# Altium schematic sheet 03_GPRS.SchDoc
size A3; DocumentNumber: 3; SheetNumber: 3; SheetTotal: 5
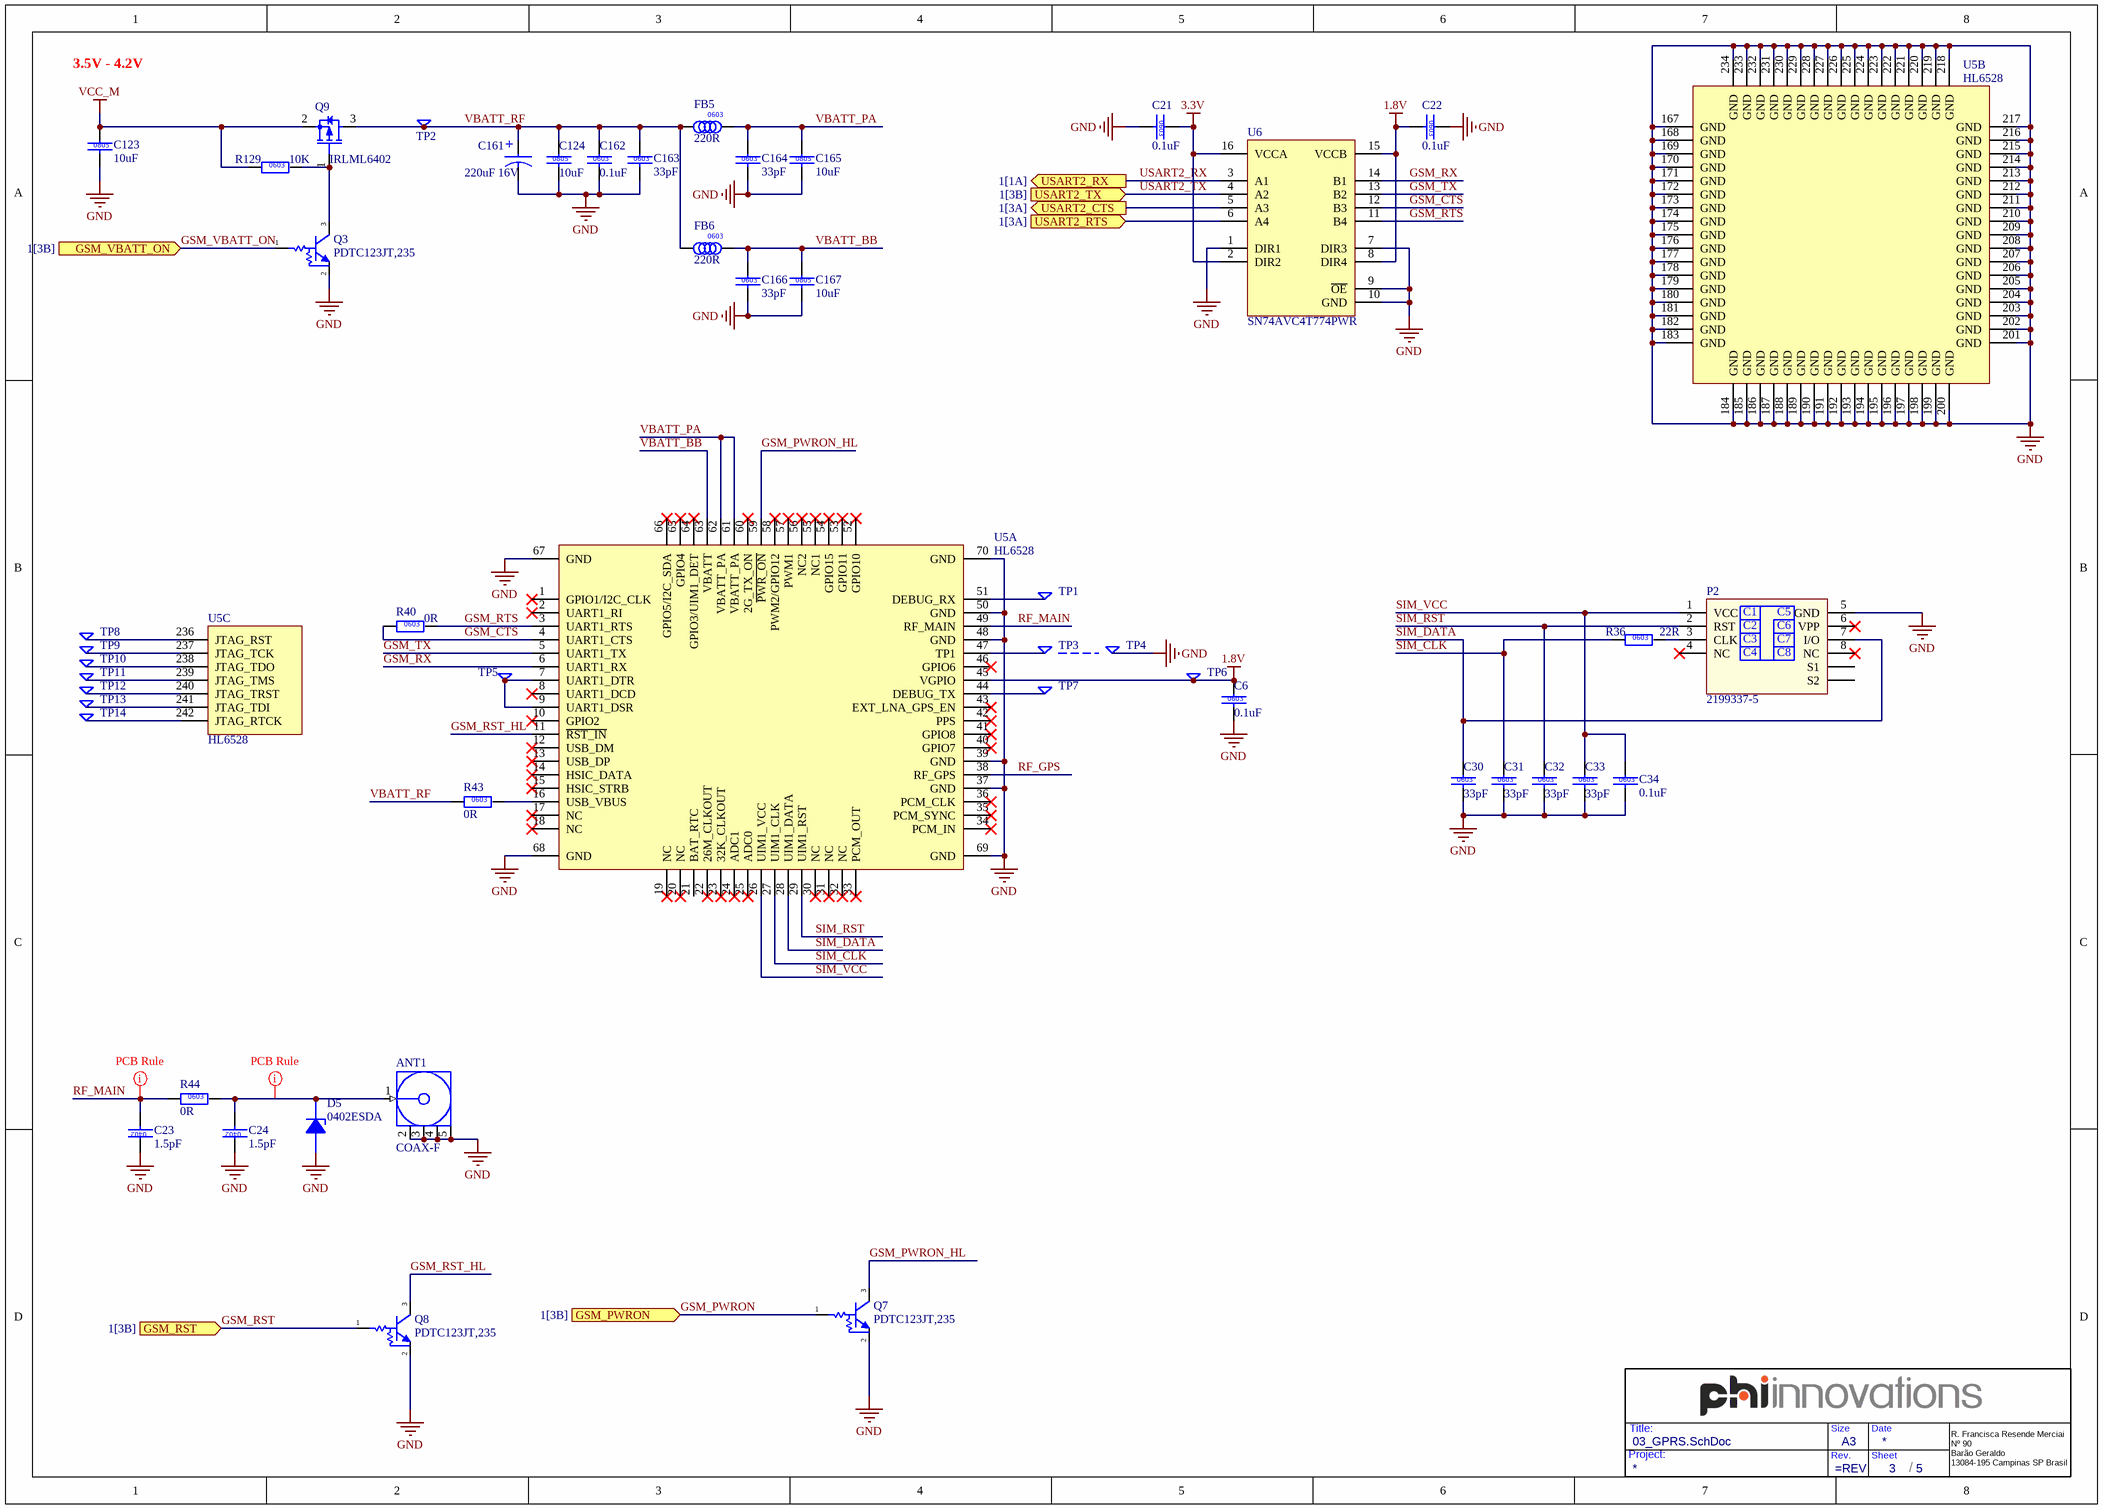
[diagram p0: 03_GPRS.SchDoc]

## Parts
?  (no value)  (graphical)
ANT1  COAX-F  [antena]
C6  0.1uF  [0603C]
C21  0.1uF  [0603C]
C22  0.1uF  [0603C]
C23  1.5pF  [0402C]
C24  1.5pF  [0402C]
C30  33pF  [0603C]
C31  33pF  [0603C]
C32  33pF  [0603C]
C33  33pF  [0603C]
C34  0.1uF  [0603C]
C123  10uF  [0805C]
C124  10uF  [0805C]
C161  220uF 16V  [CAP_RADIAL_6X11]
C162  0.1uF  [0603C]
C163  33pF  [0603C]
C164  33pF  [0603C]
C165  10uF  [0805C]
C166  33pF  [0603C]
C167  10uF  [0805C]
D5  0402ESDA  [0402ESD]
FB5  220R  [0603L]
FB6  220R  [0603L]
P2  2199337-5  [SIM_MICRO_2108431-3]
Q3  PDTC123JT,235  [SOT-23-3]
Q7  PDTC123JT,235  [SOT-23-3]
Q8  PDTC123JT,235  [SOT-23-3]
Q9  IRLML6402  [SOT-23]
R36  22R  [0603R]
R40  0R  [0603R]
R43  0R  [0603R]
R44  0R  [0603R]
R129  10K  [0603R]
TP1  TP  [TP]  (value not drawn)  (no BOM)
TP2  TP  [TP]  (value not drawn)  (no BOM)
TP3  TP  [TP]  (value not drawn)  (no BOM)
TP4  TP  [TP]  (value not drawn)  (no BOM)
TP5  TP  [TP]  (value not drawn)  (no BOM)
TP6  TP  [TP]  (value not drawn)  (no BOM)
TP7  TP  [TP]  (value not drawn)  (no BOM)
TP8  TP  [TP]  (value not drawn)  (no BOM)
TP9  TP  [TP]  (value not drawn)  (no BOM)
TP10  TP  [TP]  (value not drawn)  (no BOM)
TP11  TP  [TP]  (value not drawn)  (no BOM)
TP12  TP  [TP]  (value not drawn)  (no BOM)
TP13  TP  [TP]  (value not drawn)  (no BOM)
TP14  TP  [TP]  (value not drawn)  (no BOM)
U5  HL6528  [3G_HL8549]  (parts A,B,C of 3)
U6  SN74AVC4T774PWR  [TSSOP16]

## Ports
GSM_PWRON (in, see 1[3B]), GSM_RST (in, see 1[3B]), GSM_VBATT_ON (in, see 1[3B]), USART2_CTS (out, see 1[3A]), USART2_RTS (in, see 1[3A]), USART2_RX (out, see 1[1A]), USART2_TX (in, see 1[3B])

## Nets
1.8V: C6.1 C22.2 TP6.1 U5.45(VGPIO) U6.8(DIR4) U6.15(VCCB)
3.3V: C21.1 U6.2(DIR2) U6.16(VCCA)
GND: ANT1.2(GND) ANT1.3(GND) ANT1.4(GND) ANT1.5(GND) C6.2 C21.2 C22.1 C23.1 C24.1 C30.2 C31.2 C32.2 C33.2 C34.2 C123.2 C124.2 C161.2 C162.2 C163.2 C164.2 C165.2 C166.2 C167.2 D5.2(A) P2.5(GND) Q3.2(E) Q7.2(E) Q8.2(E) TP4.1 U5.37(GND) U5.39(GND) U5.48(GND) U5.50(GND) U5.67(GND) U5.68(GND) U5.69(GND) U5.70(GND) U5.167(GND) U5.168(GND) U5.169(GND) U5.170(GND) U5.171(GND) U5.172(GND) U5.173(GND) U5.174(GND) U5.175(GND) U5.176(GND) U5.177(GND) U5.178(GND) U5.179(GND) U5.180(GND) U5.181(GND) U5.182(GND) U5.183(GND) U5.184(GND) U5.185(GND) U5.186(GND) U5.187(GND) U5.188(GND) U5.189(GND) U5.190(GND) U5.191(GND) U5.192(GND) U5.193(GND) U5.194(GND) U5.195(GND) U5.196(GND) U5.197(GND) U5.198(GND) U5.199(GND) U5.200(GND) U5.201(GND) U5.202(GND) U5.203(GND) U5.204(GND) U5.205(GND) U5.206(GND) U5.207(GND) U5.208(GND) U5.209(GND) U5.210(GND) U5.211(GND) U5.212(GND) U5.213(GND) U5.214(GND) U5.215(GND) U5.216(GND) U5.217(GND) U5.218(GND) U5.219(GND) U5.220(GND) U5.221(GND) U5.222(GND) U5.223(GND) U5.224(GND) U5.225(GND) U5.226(GND) U5.227(GND) U5.228(GND) U5.229(GND) U5.230(GND) U5.231(GND) U5.232(GND) U5.233(GND) U5.234(GND) U6.1(DIR1) U6.7(DIR3) U6.9(~{OE}) U6.10(GND)
VCC_M: C123.1 Q9.2(S) R129.1
GSM_CTS: R40.1 U5.4(UART1_CTS) U6.12(B3)
GSM_PWRON: Q7.1(B) ; port GSM_PWRON
GSM_PWRON_HL: Q7.3(C) U5.59(~{PWR_ON})
GSM_RST: Q8.1(B) ; port GSM_RST
GSM_RST_HL: Q8.3(C) U5.11(~{RST_IN})
GSM_RTS: R40.2 U5.3(UART1_RTS) U6.11(B4)
GSM_RX: U5.6(UART1_RX) U6.14(B1)
GSM_TX: U5.5(UART1_TX) U6.13(B2)
GSM_VBATT_ON: Q3.1(B) ; port GSM_VBATT_ON
RF_GPS: U5.38(RF_GPS)
RF_MAIN: C23.2 R44.1 U5.49(RF_MAIN)
SIM_CLK: C31.1 R36.1 U5.27(UIM1_CLK)
SIM_DATA: C30.1 P2.7(I/O) U5.28(UIM1_DATA)
SIM_RST: C32.1 P2.2(RST) U5.29(UIM1_RST)
SIM_VCC: C33.1 C34.1 P2.1(VCC) U5.26(UIM1_VCC)
USART2_CTS: U6.5(A3) ; port USART2_CTS
USART2_RTS: U6.6(A4) ; port USART2_RTS
USART2_RX: U6.3(A1) ; port USART2_RX
USART2_TX: U6.4(A2) ; port USART2_TX
VBATT_BB: C166.1 C167.1 FB6.2 U5.63(VBATT)
VBATT_PA: C164.1 C165.1 FB5.2 U5.61(VBATT_PA) U5.62(VBATT_PA)
VBATT_RF: C124.1 C161.1 C162.1 C163.1 FB5.1 FB6.1 Q9.3(D) R43.1 TP2.1
NetANT1_1: ANT1.1(Signal) C24.2 D5.1(K) R44.2
NetP2_3: P2.3(CLK) R36.2
NetQ3_3: Q3.3(C) Q9.1(G) R129.2
NetR43_2: R43.2 U5.16(USB_VBUS)
NetTP1_1: TP1.1 U5.51(DEBUG_RX)
NetTP3_1: TP3.1 U5.47(TP1)
NetTP5_1: TP5.1 U5.7(UART1_DTR) U5.9(UART1_DSR)
NetTP7_1: TP7.1 U5.44(DEBUG_TX)
NetTP8_1: TP8.1 U5.236(JTAG_RST)
NetTP9_1: TP9.1 U5.237(JTAG_TCK)
NetTP10_1: TP10.1 U5.238(JTAG_TDO)
NetTP11_1: TP11.1 U5.239(JTAG_TMS)
NetTP12_1: TP12.1 U5.240(JTAG_TRST)
NetTP13_1: TP13.1 U5.241(JTAG_TDI)
NetTP14_1: TP14.1 U5.242(JTAG_RTCK)

Not connected (* = marked no-connect by the designer): P2 4(NC)* 6(VPP)* 8(NC)* S1 S2; U5 1(GPIO1/I2C_CLK)* 2(UART1_RI)* 8(UART1_DCD)* 10(GPIO2)* 12(USB_DM)* 13(USB_DP)* 14(HSIC_DATA)* 15(HSIC_STRB)* 17(NC)* 18(NC)* 19(NC)* 20(NC)* 21(BAT_RTC) 22(26M_CLKOUT)* 23(32K_CLKOUT)* 24(ADC1)* 25(ADC0)* 30(NC)* 31(NC)* 32(NC)* 33(PCM_OUT)* 34(PCM_IN)* 35(PCM_SYNC)* 36(PCM_CLK)* 40(GPIO7)* 41(GPIO8)* 42(PPS)* 43(EXT_LNA_GPS_EN)* 46(GPIO6)* 52(GPIO10)* 53(GPIO11)* 54(GPIO15)* 55(NC1)* 56(NC2)* 57(PWM1)* 58(PWM2/GPIO12)* 60(2G_TX_ON)* 64(GPIO3/UIM1_DET)* 65(GPIO4)* 66(GPIO5/I2C_SDA)*

## Layout directives
rule Clearance Constraint [Clearance = 0.254mm]; rule Width Constraint [Pref Width = 0.35mm    Min Width = 0.35mm    Max Width = 0.35mm]: NetANT1_1, RF_MAIN

## Notes on the sheet
- 3.5V - 4.2V
- Project:
- Title:
- Rev.
- Size
- Sheet
- Date
- /
- R. Francisca Resende Merciai
  Nº 90
  Barão Geraldo
  13084-195 Campinas SP Brasil
- (in symbol PHI100.0.0603.000R.001.1/10W) 0603
- (in symbol PHI101.0.0603.010K.001.1/10W) 0603
- (in symbol PHI201.0.0402.001p5.020.050V.C0G) 0402
- (in symbol PHI201.0.0603.000u1.005.050V.X7R) 0603
- (in symbol PHI201.0.0603.0033p.010.050V.C0G) 0603
- (in symbol PHI201.0.0805.0010u.010.010V.X5R) 0805
- (in symbol PHI202.0.000C.0220u.020.16V.XXX) +
- (in symbol PHI350.0.0603.0220R.XXX.0002A.050mOHM) 0603
- (in symbol RES0603) 0603
- (in symbol SIM_Connector) C1; C5; C2; C6; C3; C7; C4; C8

## Library data of the parts
? = Title_Block3
ANT1 = COAX-F: CONN SMA JACK R/A 50 OHM PCB; Manufacturer: TE Connectivity AMP Connectors; Part Number: 5-1814400-1; SCH Info: 2G/3G; Supplier 1: Digi-Key; Supplier Part Number 1: A97593-ND; Fabricante 1: TE Connectivity AMP Connectors; Partnumber fabricante 1: 5-1814400-1; P Description: CONN SMA JACK R/A 50 OHM PCB; PN distribuidor 1 / Fab 1: A97593-ND; Value: JACK R/A 50 OHM
C6 C21 C22 C162 = PHI201.0.0603.000u1.005.050V.X7R: CAP0603; Partnumber fabricante 1: 06035C104JAT2A; Fabricante 1: AVX Corporation; P Description: Capacitor ceramico 0603 0.1uF 20% 50V X7R; SCH Info: 2G/3G; Partnumber PHI: PHI201.0.0603.000u1.005.050V.X7R; Datasheet fabricante 1: http://datasheets.avx.com/X7RDielectric.pdf; Distribuidor 1: Digi Key; PN distribuidor 1 / Fab 1: 478-5778-1-ND; Distribuidor 2: Mouser; Value: 0.1uF
C23 C24 = PHI201.0.0402.001p5.020.050V.C0G: CAP0402; Partnumber fabricante 1: GRM1555C1H1R5CA01D; Fabricante 1: Murata Electronics North America; P Description: Capacitor ceramico 0402 2.2pF 5% 50V C0G; SCH Info: 2G/3G; Partnumber PHI: PHI201.0.0402.001p5.020.050V.C0G; Datasheet fabricante 1: http://search.murata.co.jp/Ceramy/image/img/A01X/partnumbering_e_01.pdf; Partnumber fabricante 2: XXXX; Distribuidor 1: Digi Key; PN distribuidor 1 / Fab 1: 490-5891-1-ND; Distribuidor 2: Mouser; Value: 1.5pF
C30-C33 = PHI201.0.0603.0033p.010.050V.C0G: CAP0603; Partnumber fabricante 1: GRM1885C1H330JA01D; Fabricante 1: Murata Electronics North America; P Description: Capacitor ceramico 0603 33pF 10% 50V C0G; Partnumber PHI: PHI201.0.0603.0033p.010.050V.C0G; Datasheet fabricante 1: http://search.murata.co.jp/Ceramy/image/img/A01X/partnumbering_e_01.pdf; Distribuidor 1: Digi Key; PN distribuidor 1 / Fab 1: 490-1415-1-ND; Distribuidor 2: Mouser; Value: 33pF
C34 = PHI201.0.0603.000u1.005.050V.X7R: CAP0603; Partnumber fabricante 1: 06035C104JAT2A; Fabricante 1: AVX Corporation; P Description: Capacitor ceramico 0603 0.1uF 20% 50V X7R; Partnumber PHI: PHI201.0.0603.000u1.005.050V.X7R; Datasheet fabricante 1: http://datasheets.avx.com/X7RDielectric.pdf; Distribuidor 1: Digi Key; PN distribuidor 1 / Fab 1: 478-5778-1-ND; Distribuidor 2: Mouser; Value: 0.1uF
C123 C124 C165 C167 = PHI201.0.0805.0010u.010.010V.X5R: CAP0805; Partnumber fabricante 1: 0805ZD106MAT2A; Fabricante 1: AVX Corporation; P Description: Capacitor ceramico 0805 10uF 10% 10V X5R; Partnumber PHI: PHI201.0.0805.0010u.010.010V.X5R; Datasheet fabricante 1: http://datasheets.avx.com/cx5r.pdf; Distribuidor 1: Digi Key; PN distribuidor 1 / Fab 1: 478-5326-1-ND; Distribuidor 2: Mouser; Value: 10uF
C161 = PHI202.0.000C.0220u.020.16V.XXX: CAP_AL_EL_13mm; Partnumber fabricante 1: B41827A4227M007; Fabricante 1: EPCOS; P Description: CAP ALUM 220UF 20% 16V RADIAL; Partnumber PHI: PHI202.0.000C.0220u.020.16V.XXX; Datasheet fabricante 1: https://media.digikey.com/pdf/Data%20Sheets/Epcos%20PDFs/B41827_B43827.pdf; Distribuidor 1: Digi Key; PN distribuidor 1 / Fab 1: B41827A4227M007; PN distribuidor 1 / Fab 2: B41827A4227M-ND; Distribuidor 2: Mouser; Value: 220uF 16V
C163 C164 C166 = PHI201.0.0603.0033p.010.050V.C0G: CAP0603; Partnumber fabricante 1: GRM1885C1H330JA01D; Fabricante 1: Murata Electronics North America; P Description: Capacitor ceramico 0603 33pF 10% 50V C0G; SCH Info: 2G/3G; Partnumber PHI: PHI201.0.0603.0033p.010.050V.C0G; Datasheet fabricante 1: http://search.murata.co.jp/Ceramy/image/img/A01X/partnumbering_e_01.pdf; Distribuidor 1: Digi Key; PN distribuidor 1 / Fab 1: 490-1415-1-ND; Distribuidor 2: Mouser; Value: 33pF
D5 = PHI430.0.0402ESDA-MLP1: Fabricante 1: Eaton; P Description: SUPPRESSOR ESD 30VDC 0402 HFREE; SCH Info: 2G/3G; Partnumber PHI: PHI430.0.0402ESDA-MLP1; Partnumber fabricante 1: 0402ESDA-MLP1; Datasheet fabricante 1: http://www.cooperindustries.com/content/dam/public/bussmann/Electronics/Resources/product-datasheets/Bus_Elx_DS_0402ESDA_MLP1_ESD_Suppressor.pdf; Distribuidor 1: Digi Key; PN distribuidor 1 / Fab 1: 283-2964-1-ND; Distribuidor 2: Mouser; Value: 0402ESDA
FB5 FB6 = PHI350.0.0603.0220R.XXX.0002A.050mOHM: FB0603; Partnumber fabricante 1: BLM18EG221SN1D; Fabricante 1: Murata Electronics North America; P Description: Ferrite Bead Chip 0603 220OHM 2A 50mOHM; SCH Info: 2G/3G; Partnumber PHI: PHI350.0.0603.0220R.XXX.0002A.050mOHM; Datasheet fabricante 1: http://search.murata.co.jp/Ceramy/image/img/PDF/ENG/L0110S0101BLM18E.pdf; Distribuidor 1: Digi Key; PN distribuidor 1 / Fab 1: 490-3992-1-ND; Distribuidor 2: Mouser; Value: 220R
P2 = SIM_Connector: ASS'Y FOR MICRO SIM H1.24 8POS; Manufacturer: TE Connectivity AMP Connectors; P Description: CONN MICRO SIM CARD PUSH-PULL; Supplier 1: Digi-Key; Distribuidor 1: Digi-Key; Fabricante 1: TE Connectivity AMP Connectors; Partnumber fabricante 1: 2199337-5; PN distribuidor 1 / Fab 1: A125065CT-ND; Value: 2199337-5
Q3 = PHI530.0.PDTC123JT,235: BJT_PB_NPN_SOT23-3; Fabricante 1: NXP Semiconductors; P Description: TRANS PREBIAS NPN 250MW TO236AB; SCH Info: GERAL; Partnumber PHI: PHI530.0.PDTC123JT,235; Partnumber fabricante 1: PDTC123JT,235; Datasheet fabricante 1: http://www.nxp.com/documents/data_sheet/PDTC123J_SER.pdf; Distribuidor 1: Digi Key; PN distribuidor 1 / Fab 1: 568-2154-1-ND; Distribuidor 2: Mouser; Value: PDTC123JT,235
Q7 Q8 = PHI530.0.PDTC123JT,235: BJT_PB_NPN_SOT23-3; Fabricante 1: NXP Semiconductors; P Description: TRANS PREBIAS NPN 250MW TO236AB; SCH Info: 2G/3G; Partnumber PHI: PHI530.0.PDTC123JT,235; Partnumber fabricante 1: PDTC123JT,235; Datasheet fabricante 1: http://www.nxp.com/documents/data_sheet/PDTC123J_SER.pdf; Distribuidor 1: Digi Key; PN distribuidor 1 / Fab 1: 568-2154-1-ND; Distribuidor 2: Mouser; Value: PDTC123JT,235
Q9 = PHI500.0.IRLML6402TRPBF: P-Channel MOSFET; Fabricante 1: Infineon Technologies Americas Corp; P Description: MOSFET P CH SOT-23 20V 3.7A; SCH Info: GERAL; Partnumber PHI: PHI500.0.IRLML6402TRPBF; Partnumber fabricante 1: IRLML6402TRPBF; Datasheet fabricante 1: http://www.irf.com/product-info/datasheets/data/irlml6402pbf.pdf; Distribuidor 1: Digi Key; PN distribuidor 1 / Fab 1: IRLML6402PBFCT-ND; Distribuidor 2: Mouser; Value: IRLML6402
R36 = RES0603: Part Number: RES SMD 22 OHM 1% 1/10W 0603; Partnumber fabricante 1: RC0603FR-0722RL; Partnumber PHI: PHI100.0.0603.022R.001.1/10W; Fabricante 1: Yageo; P Description: Resistor SMD 0603 22R 1% 1/10W; Fabricante 2: Stackpole Electronics Inc; Supplier 1: Digi-Key; Supplier Part Number 1: 311-22.0HRCT-ND; Datasheet fabricante 1: http://www.yageo.com/NewPortal/yageodocoutput?fileName=/pdf/R-Chip/PYu-RC_Group_51_RoHS_L_3.pdf; Distribuidor 1: Digi Key; Distribuidor 2: Mouser; PN distribuidor 1 / Fab 1: 311-22.0HRCT-ND; Value: 22R; Datasheet fabricante 2: http://www.seielect.com/Catalog/SEI-RMCF_RMCP.pdf; Partnumber fabricante 2: RMCF0603FT22R0; PN distribuidor 1 / Fab 2: RMCF0603FT22R0CT-ND
R40 R43 R44 = PHI100.0.0603.000R.001.1/10W: RES0603; Partnumber fabricante 1: RC0603JR-070RL; Fabricante 1: Yageo; Fabricante 2: Panasonic Electronic Components; P Description: Resistor SMD 0603 0R JUMPER 1/10W; SCH Info: 2G/3G; Partnumber PHI: PHI100.0.0603.000R.001.1/10W; Datasheet fabricante 1: http://www.yageo.com/NewPortal/yageodocoutput?fileName=/pdf/R-Chip/PYu-RC_Group_51_RoHS_L_3.pdf; Partnumber fabricante 2: ERJ-3GEY0R00V; Datasheet fabricante 2: http://industrial.panasonic.com/www-cgi/jvcr13pz.cgi?E+PZ+3+AOA0001+ERJ3GEY0R00V+7+WW; Distribuidor 1: Digi Key; PN distribuidor 1 / Fab 1: 311-0.0GRCT-ND; PN distribuidor 1 / Fab 2: P0.0GTR-ND; Distribuidor 2: Mouser; Value: 0R
R129 = PHI101.0.0603.010K.001.1/10W: RES0603; Partnumber fabricante 1: RC0603FR-0710KL; Fabricante 1: Yageo; Fabricante 2: Stackpole Electronics Inc; P Description: Resistor SMD 0603 10K 1% 1/08W; SCH Info: 2G/3G; Partnumber PHI: PHI101.0.0603.010K.001.1/10W; Datasheet fabricante 1: http://www.yageo.com/documents/recent/PYu-RC_Group_51_RoHS_L_04.pdf; Partnumber fabricante 2: RNCP0603FTD10K0; Datasheet fabricante 2: http://www.seielect.com/catalog/SEI-RNCP.pdf; Distribuidor 1: Digi Key; PN distribuidor 1 / Fab 1: 311-10.0KHRCT-ND; PN distribuidor 1 / Fab 2: RMCF0603FT10K0CT-ND; Distribuidor 2: Mouser; Value: 10K
TP1-TP14 = TP: Test Point; PCB INFO: DNP; SCH Info: 2G/3G
U5 = PHI800.0.HL6528: Partnumber fabricante 1: HL6528-2.8VBR; Fabricante 1: Sierra Wireless; P Description: GSM MODEM GPRS; SCH Info: 2G/3G; Partnumber PHI: PHI800.0.HL6528; Datasheet fabricante 1: http://source.sierrawireless.com/devices/hl-series/hl6528/; Value: HL6528
U6 = PHI800.0.SN74AVC4T774PWR: IC BUS TRANSCVR 4BIT DL; Fabricante 1: Texas Instruments; P Description: IC BUS TRANSCVR 4BIT DL 16TSSOP; Value: MAX3232-TSSOP; SCH Info: 2G/3G; Partnumber PHI: PHI800.0.SN74AVC4T774PWR; Partnumber fabricante 1: SN74AVC4T774PWR; Datasheet fabricante 1: http://www.ti.com/lit/ds/symlink/sn74avc4t774.pdf; Distribuidor 1: Digi Key; PN distribuidor 1 / Fab 1: 296-24739-1-ND; Distribuidor 2: Mouser